# EAGLE design midiMeterClock (EAGLE 5.06)
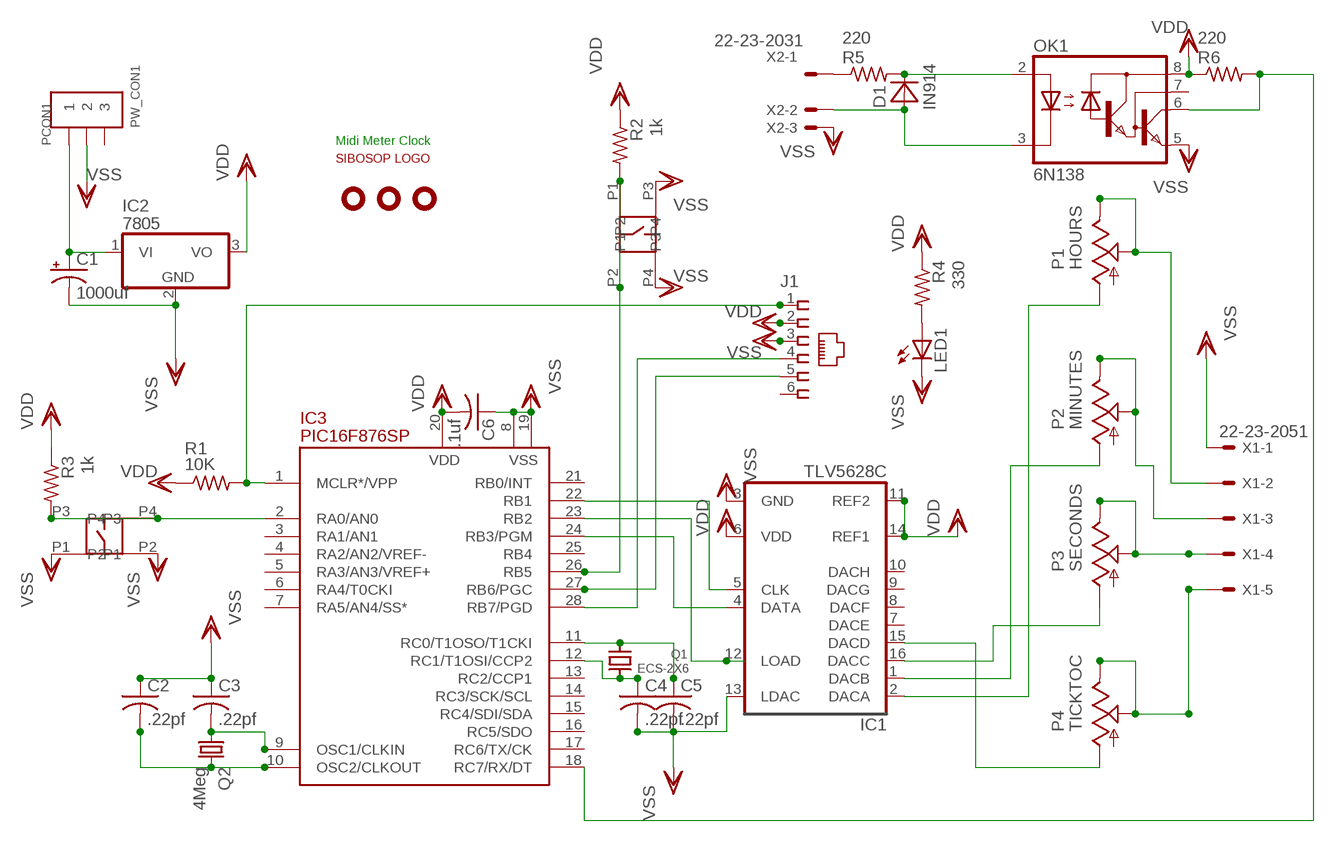
[diagram p0: schematic, sheet 1]

## Parts
C1  1000uf  CPOL-USE3.5-10  [E3,5-10]
C2  .22pf  C-US025-024X044  [C025-024X044]
C3  .22pf  C-US025-024X044  [C025-024X044]
C4  .22pf  C-US025-024X044  [C025-024X044]
C5  .22pf  C-US025-024X044  [C025-024X044]
C6  .1uf  C-US025-024X044  [C025-024X044]
D1  IN914  [DO35-10]
IC1  TLV5628C  [DIL16]
IC2  7805  [TO220V]
IC3  PIC16F876SP  [DIL28-3]
J1  520250-3  [520250-3]
LED1  LEDSQR2X5  [LED2X5]
OK1  6N138  [DIL08]
P1  HOURS  TRIMPOT  [RJ6S]
P2  MINUTES  TRIMPOT  [RJ6S]
P3  SECONDS  TRIMPOT  [RJ6S]
P4  TICKTOC  TRIMPOT  [RJ6S]
PCON1  PW_CON1  [PW_CON1]
Q1  ECS-2X6  [RADIAL-CRYSTAL-2.1MM]
Q2  4Meg  CRYSTALHC49S  [HC49/S]
R1  10K  R-US_0204/2V  [0204V]
R2  1k  R-US_0204/2V  [0204V]
R3  1k  R-US_0204/2V  [0204V]
R4  330  R-US_0204/2V  [0204V]
R5  220  R-US_0204/2V  [0204V]
R6  220  R-US_0204/2V  [0204V]
SW1  SW-B3W-1052  [SW-B3W-1052]
SW2  SW-B3W-1052  [SW-B3W-1052]
U$1  HOLE-125  [HOLE-125]
U$2  HOLE-125  [HOLE-125]
U$3  LOGO  [LOGO]
U$5  HOLE-125  [HOLE-125]
X1  22-23-2051  [22-23-2051]
X2  22-23-2031  [22-23-2031]

## Nets
N$1: IC3.1(MCLR*/VPP) J1.1 R1.2
N$2: C1.+ IC2.1(VI) PCON1.P$1
N$3: C2.2 IC3.10(OSC2/CLKOUT) Q2.2
N$4: C3.2 IC3.9(OSC1/CLKIN) Q2.1
N$5: P1.E P1.S X1.2
N$6: C5.1 IC3.11(RC0/T1OSO/T1CKI) Q1.1
N$7: C4.1 IC3.12(RC1/T1OSI/CCP2) Q1.2
N$8: P2.E P2.S X1.3
N$9: P3.E P3.S X1.4
N$10: P4.E P4.S X1.5
N$11: IC1.4(DATA) IC3.24(RB3/PGM)
N$12: IC3.2(RA0/AN0) R3.2 SW1.P3 SW1.P4
N$13: IC3.26(RB5) R2.2 SW2.P1 SW2.P2
N$14: IC3.27(RB6/PGC) J1.5
N$15: IC1.12(LOAD) IC3.23(RB2)
N$16: IC1.5(CLK) IC3.22(RB1)
N$17: IC1.16(DACC) P3.A
N$18: IC1.2(DACA) P1.A
N$19: IC1.1(DACB) P2.A
N$20: IC1.15(DACD) P4.A
N$21: IC3.28(RB7/PGD) J1.4
N$22: LED1.A R4.2
N$23: R5.1 X2.1
N$24: D1.C OK1.2(A) R5.2
N$25: D1.A OK1.3(C) X2.2
N$26: IC3.18(RC7/RX/DT) OK1.6(VO) R6.2
VDD: C6.2 IC1.6(VDD) IC1.11(REF2) IC1.14(REF1) IC2.3(VO) IC3.20(VDD) J1.2 OK1.8(VCC) R1.1 R2.1 R3.1 R4.1 R6.1
VSS: C1.- C2.1 C3.1 C4.2 C5.2 C6.1 IC1.3(GND) IC1.13(LDAC) IC2.2(GND) IC3.8(VSS) IC3.19(VSS) J1.3 LED1.K(C) OK1.5(GND) PCON1.P$2 SW1.P1 SW1.P2 SW2.P3 SW2.P4 X1.1 X2.3
Unconnected: IC1.7(DACE) IC1.8(DACF) IC1.9(DACG) IC1.10(DACH) IC3.3(RA1/AN1) IC3.4(RA2/AN2/VREF-) IC3.5(RA3/AN3/VREF+) IC3.6(RA4/T0CKI) IC3.7(RA5/AN4/SS*) IC3.13(RC2/CCP1) IC3.14(RC3/SCK/SCL) IC3.15(RC4/SDI/SDA) IC3.16(RC5/SDO) IC3.17(RC6/TX/CK) IC3.21(RB0/INT) IC3.25(RB4) J1.6 OK1.7(VB) PCON1.P$3

## Notes on the sheet
- Midi Meter Clock

## Library data of the parts
C1 = rcl:CPOL-US: POLARIZED CAPACITOR, American symbol
C2-C6 = rcl:C-US: CAPACITOR, American symbol
D1 = kmarx1:IN914: DIODE SWITCH, 1N914 MFG:VISHAY - 100PRV@25mA, 1Vf@10mA(10) Jameco #: 179207 OR 75V PRV @Ir5uA, Vf=1V@10mA (10) Jameco #: 3631
IC1 = kmarx1:TLV5628C
IC2 = kmarx1:78*: 78xx Family - Positive voltage regulator
IC3 = pic16f87x:PIC16F876: FLASH MICROCONTROLLER
J1 = con-amp:520250-3: AMP connector
LED1 = led:LED: LED OSRAM: - CHIPLED LG R971, LG N971, LY N971, LG Q971, LY Q971, LO R971, LY R971 LH N974, LH R974 LS Q976, LO Q976, LY Q976 LO Q996 - Hyper CHIPLED LW Q18S LB Q993, LB Q99A, LB R99A - SideLED LS A670, LO A670, LY A670, LG A670, LP A670 LB A673, LV A673, LT A673, LW A673 LH A674 LY A675 LS A676, LA A676, LO A676, LY A676, LW A676 LS A679, LY A679, LG A679 - Hyper Micro SIDELED® LS Y876, LA Y876, LO Y876, LY Y876 LT Y87S - SmartLED LW L88C, LW L88S LB L89C, LB L89S, LG L890 LS L89K, LO L89K, LY L89K LS L896, LA L896, LO L896, LY L896 - TOPLED LS T670, LO T670, LY T670, LG T670, LP T670 LSG T670, LSP T670, LSY T670, LOP T670, LYG T670 LG T671, LOG T671, LSG T671 LB T673, LV T673, LT T673, LW T673 LH T674 LS T676, LA T676, LO T676, LY T676, LB T676, LH T676, LSB T676, LW T676 LB T67C, LV T67C, LT T67C, LS T67K, LO T67K, LY T67K, LW E67C LS E67B, LA E67B, LO E67B, LY E67B, LB E67C, LV E67C, LT E67C LW T67C LS T679, LY T679, LG T679 LS T770, LO T770, LY T770, LG T770, LP T770 LB T773, LV T773, LT T773, LW T773 LH T774 LS E675, LA E675, LY E675, LS T675 LS T776, LA T776, LO T776, LY T776, LB T776 LHGB T686 LT T68C, LB T68C - Hyper Mini TOPLED® LB M676 - Mini TOPLED Santana® LG M470 LS M47K, LO M47K, LY M47K Source: http://www.osram.convergy.de - LUMILED® LXK2-PW12-R00, LXK2-PW12-S00, LXK2-PW14-U00, LXK2-PW14-V00 LXK2-PM12-R00, LXK2-PM12-S00, LXK2-PM14-U00 LXK2-PE12-Q00, LXK2-PE12-R00, LXK2-PE12-S00, LXK2-PE14-T00, LXK2-PE14-U00 LXK2-PB12-K00, LXK2-PB12-L00, LXK2-PB12-M00, LXK2-PB14-N00, LXK2-PB14-P00, LXK2-PB14-Q00 LXK2-PR12-L00, LXK2-PR12-M00, LXK2-PR14-Q00, LXK2-PR14-R00 LXK2-PD12-Q00, LXK2-PD12-R00, LXK2-PD12-S00 LXK2-PH12-R00, LXK2-PH12-S00 LXK2-PL12-P00, LXK2-PL12-Q00, LXK2-PL12-R00 Source: www.luxeon.com
OK1 = optocoupler:6N138: MOTOROLA OPTO COUPLER
P1-P4 = sibosop:TRIMPOT
PCON1 = powerconnectorskt:PW_CON1
Q1 = kmarx1:ECS-2X6: ECS 2x6 32khz Tuning Fork Crystal ECS-.327-12.5-13 digikey X802-ND
Q2 = crystal:CRYSTAL: CRYSTAL
R1-R6 = rcl:R-US_: RESISTOR, American symbol
SW1 SW2 = sibosop:SW-B3W-1052
U$1 U$2 U$5 = sibosop:HOLE-125
U$3 = sibosop:LOGO
X1 = sibosop-con-molex:22-23-2051: .100" (2.54mm) Center Header - 5 Pin
X2 = sibosop-con-molex:22-23-2031: .100" (2.54mm) Center Header - 3 Pin

## Board
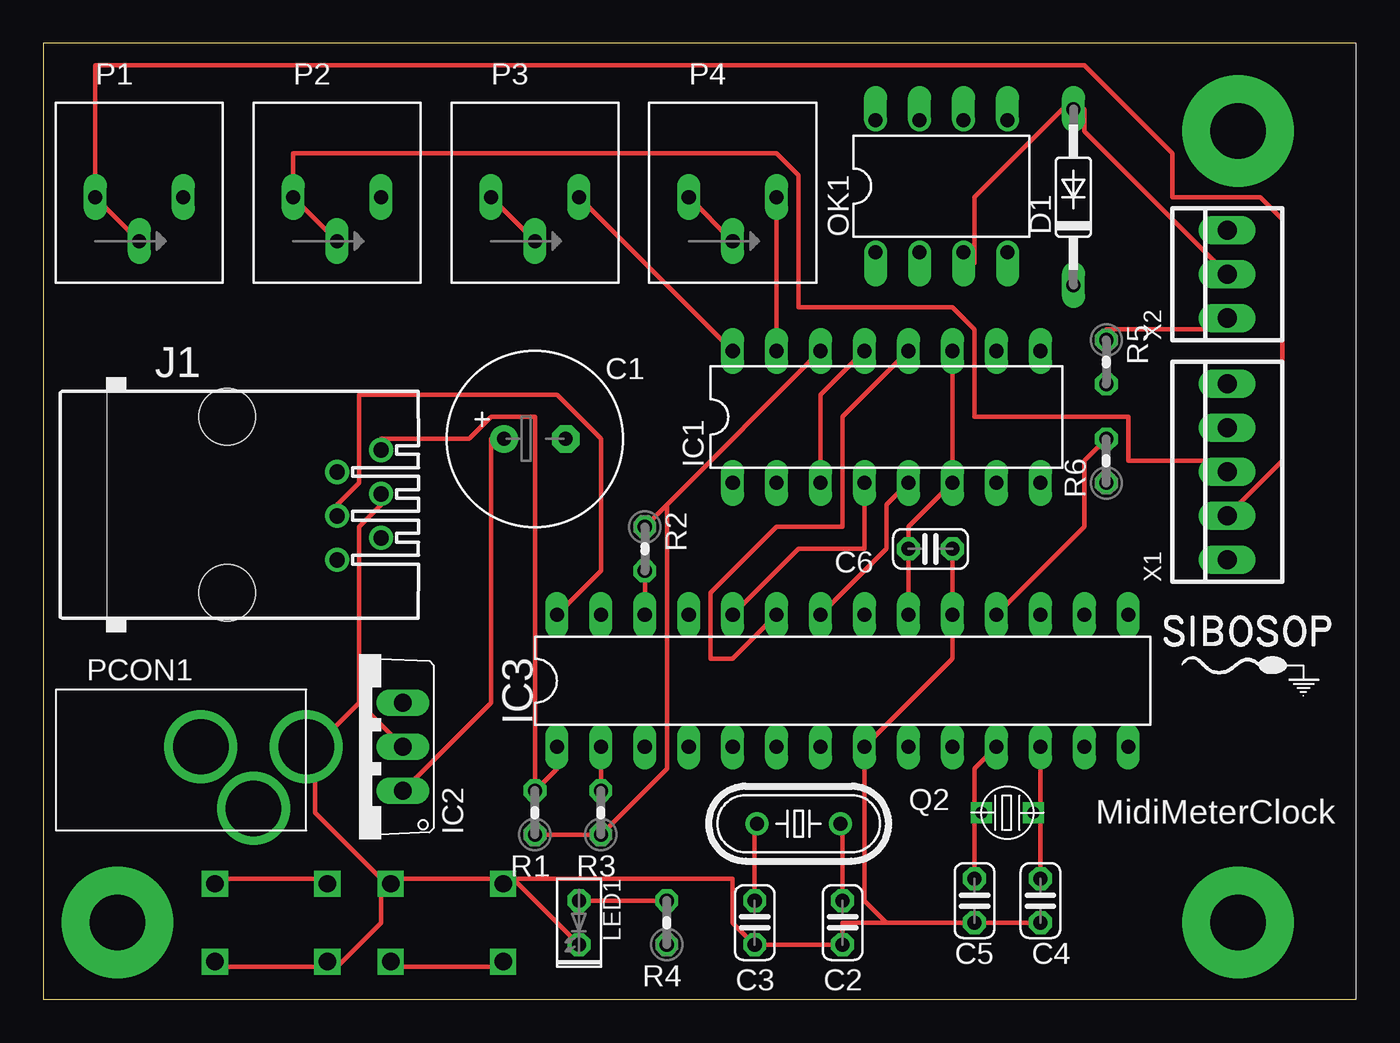
[diagram p1: board, top side]
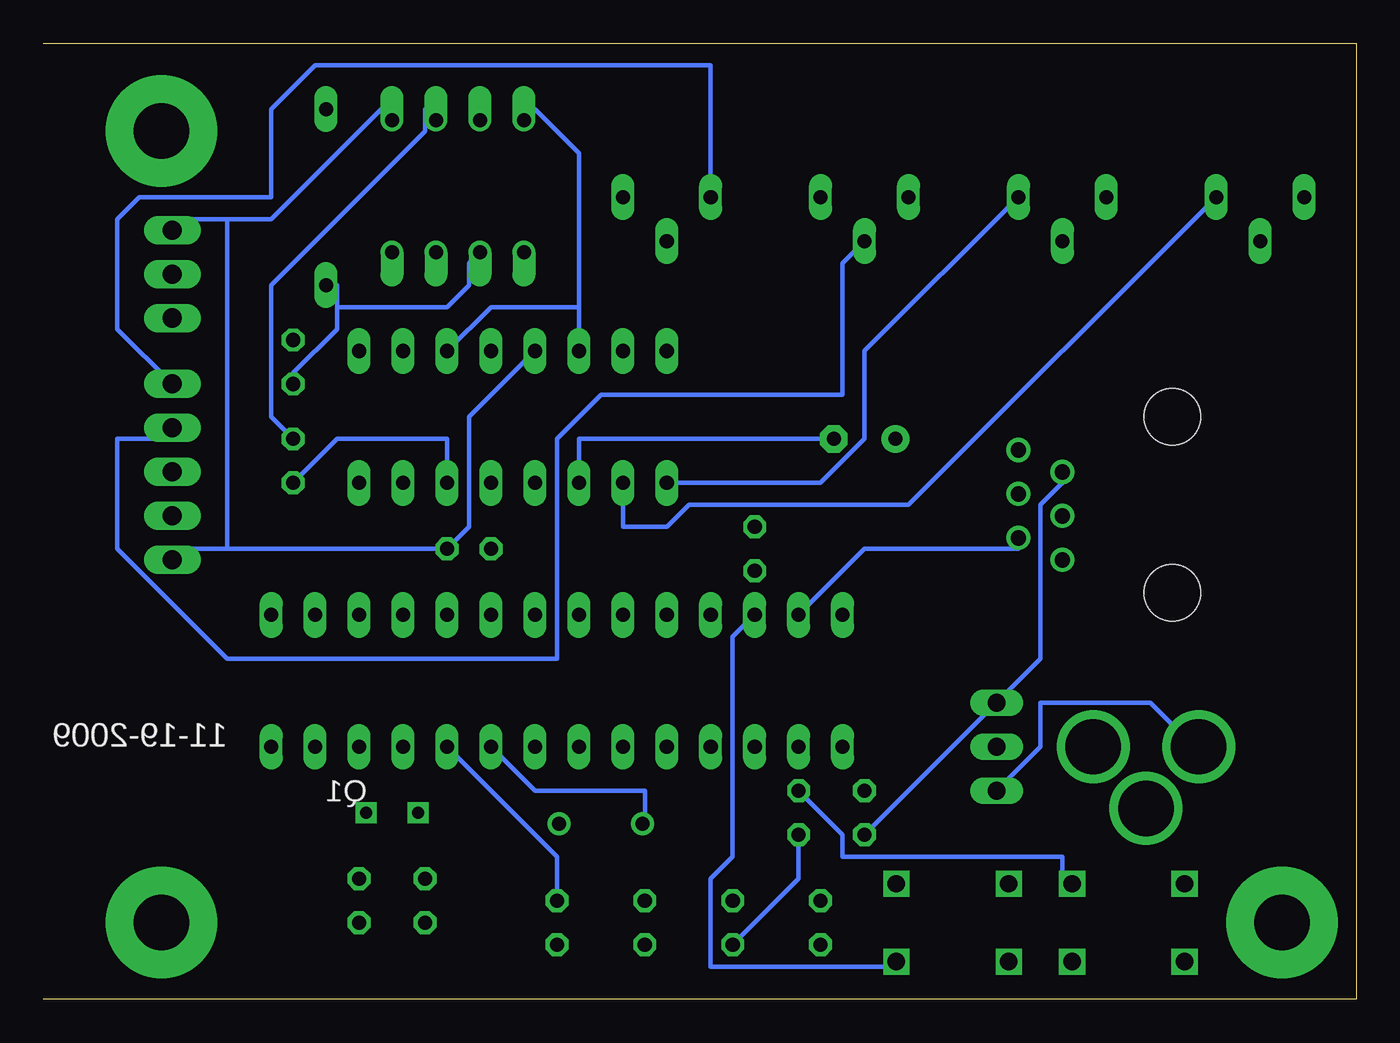
[diagram p2: board, bottom side, seen from below]

Size 75.87 x 55.23 mm. Coordinates in mm from the lower left corner, seen from the top.
Outline: 75.87,0 0,0 0,55.23 75.87,55.23
Copper layers (1*16): Top 0.035mm / dielectric 1.5mm / Bottom 0.035mm
Design rules "default": minimum track width 10mil, minimum drill 24mil, track to track 8mil, track to pad 8mil, pad to pad 8mil, via to via 8mil, smd to smd 8mil, copper to edge 40mil, drill to drill 8mil, minimum pad ring 10mil, minimum via ring 8mil, stop-mask expansion 4mil, vias tented up to drill 0mil, thermal gap 10mil

### Footprints (pad centres in the part's own frame; a part is rotated, then mirrored left to right if it is on the bottom)
E3,5-10 = drill 0.813 pad 1.6 round: + -1.778,0 | drill 0.813 pad 1.6 octagon: - 1.778,0
C025-024X044 = drill 0.813 octagon: 1 -1.27,0; 2 1.27,0
DO35-10 = drill 0.813 long: A 5.08,0; C -5.08,0
DIL16 = drill 0.813 long: 1 -8.89,-3.81; 2 -6.35,-3.81; 3 -3.81,-3.81; 4 -1.27,-3.81; 5 1.27,-3.81; 6 3.81,-3.81; 7 6.35,-3.81; 8 8.89,-3.81; 9 8.89,3.81; 10 6.35,3.81; 11 3.81,3.81; 12 1.27,3.81; 13 -1.27,3.81; 14 -3.81,3.81; 15 -6.35,3.81; 16 -8.89,3.81
TO220V = drill 1.016 long: 1 -2.54,0; 2 0,0; 3 2.54,0
DIL28-3 = drill 0.813 long: 1 -16.51,-3.81; 2 -13.97,-3.81; 3 -11.43,-3.81; 4 -8.89,-3.81; 5 -6.35,-3.81; 6 -3.81,-3.81; 7 -1.27,-3.81; 8 1.27,-3.81; 9 3.81,-3.81; 10 6.35,-3.81; 11 8.89,-3.81; 12 11.43,-3.81; 13 13.97,-3.81; 14 16.51,-3.81; 15 16.51,3.81; 16 13.97,3.81; 17 11.43,3.81; 18 8.89,3.81; 19 6.35,3.81; 20 3.81,3.81; 21 1.27,3.81; 22 -1.27,3.81; 23 -3.81,3.81; 24 -6.35,3.81; 25 -8.89,3.81; 26 -11.43,3.81; 27 -13.97,3.81; 28 -16.51,3.81
520250-3 = drill 0.889 round: 1 -3.175,8.89; 2 -1.905,6.35; 3 -0.635,8.89; 4 0.635,6.35; 5 1.905,8.89; 6 3.175,6.35 | hole 3.251: -5.08,0; 5.08,0
LED2X5 = drill 0.813 octagon: A -1.27,0; K 1.27,0
DIL08 = drill 0.813 offset: 1 -3.81,-3.81; 2 -1.27,-3.81; 3 1.27,-3.81; 4 3.81,-3.81; 5 3.81,3.81; 6 1.27,3.81; 7 -1.27,3.81; 8 -3.81,3.81
RJ6S = drill 0.813 long: A 2.54,0; E -2.54,0; S 0,-2.54
PW_CON1 = drill 3.2 pad 3.81 round: P$1 -0.254,0; P$2 5.842,0; P$3 2.794,-3.556
RADIAL-CRYSTAL-2.1MM = drill 0.7 square: 1 0,1.5; 2 0,-1.5
HC49/S = drill 0.813 round: 1 -2.413,0; 2 2.413,0
0204V = drill 0.813 octagon: 1 -1.27,0; 2 1.27,0
SW-B3W-1052 = drill 1 square: P1 3.25,-2.25; P2 -3.25,-2.25; P3 3.25,2.25; P4 -3.25,2.25
HOLE-125 = drill 3.2 pad 6.452 round: P$1 0,0
22-23-2051 = drill 1.1 long: 1 -5.08,0; 2 -2.54,0; 3 0,0; 4 2.54,0; 5 5.08,0
22-23-2031 = drill 1.1 long: 1 -2.54,0; 2 0,0; 3 2.54,0

### Placement (x,y rotation side)
C1  28.41,32.38 0 top
C2  46.19,4.44 90 top
C3  41.11,4.44 90 top
C4  57.62,5.71 270 top
C5  53.81,5.71 270 top
C6  51.27,26.03 180 top
D1  59.52,46.35 90 top
IC1  48.73,33.65 0 top
IC2  20.79,14.6 90 top
IC3  46.19,18.41 0 top
J1  10.63,28.57 270 top
LED1  30.95,4.44 270 top
OK1  51.91,46.98 0 top
P1  5.55,46.35 0 top
P2  16.98,46.35 0 top
P3  28.41,46.35 0 top
P4  39.84,46.35 0 top
PCON1  9.36,14.6 0 top
Q1  55.71,10.79 90 top
Q2  43.65,10.16 0 top
R1  28.41,10.79 90 top
R2  34.76,26.03 270 top
R3  32.22,10.79 90 top
R4  36.03,4.44 90 top
R5  61.43,36.83 270 top
R6  61.43,31.11 90 top
SW1  13.17,4.44 0 top
SW2  23.33,4.44 0 top
U$1  4.28,4.44 0 top
U$2  69.05,4.44 0 top
U$3  69.05,20.95 0 top
U$5  69.05,50.16 0 top
X1  68.41,30.47 90 top
X2  68.41,41.91 90 top

### Tracks (layer width: path | path; a pad name or v marks a point on that pad's centre or on a via)
N$1
  Top 0.254: IC3.1 29.68,13.33 R1.2 28.41,33.65 25.87,33.65 24.6,32.38 19.52,32.38 J1.1
N$2
  Top 0.254: IC2.1 25.87,17.14 25.87,32.38 C1.+
  Bottom 0.254: IC2.1 18.25,14.6 18.25,17.14 11.9,17.14 9.36,14.6 PCON1.P$1
N$3
  Top 0.254: C2.2 46.19,9.52 Q2.2
  Bottom 0.254: IC3.10 46.19,8.25 C2.2
N$4
  Top 0.254: C3.2 41.11,9.52 Q2.1
  Bottom 0.254: IC3.9 47.46,12.06 41.11,12.06 41.11,10.79 Q2.1
N$5
  Top 0.254: P1.S P1.E 3.01,53.97 60.16,53.97 65.24,48.89 65.24,46.35 70.32,46.35 71.59,45.08 71.59,31.11 X1.2
N$6
  Top 0.254: C5.1 53.81,10.79 | IC3.11 53.81,13.33 53.81,10.79 | 53.81,10.79 Q1.1
N$7
  Top 0.254: 57.62,10.79 IC3.12 | C4.1 57.62,10.79 | 57.62,10.79 Q1.2
N$8
  Top 0.254: P2.S P2.E 14.44,48.89 42.38,48.89 43.65,47.62 43.65,40 52.54,40 53.81,38.73 53.81,33.65 62.7,33.65 62.7,31.11 67.78,31.11 X1.3
N$9
  Top 0.254: P3.S P3.E
  Bottom 0.254: P3.S 29.68,42.54 29.68,34.92 43.65,34.92 46.19,32.38 46.19,19.68 65.24,19.68 71.59,26.03 71.59,32.38 69.05,32.38 X1.4
N$10
  Top 0.254: P4.S P4.E
  Bottom 0.254: P4.E 37.3,53.97 60.16,53.97 62.7,51.43 62.7,46.35 70.32,46.35 71.59,45.08 71.59,38.73 X1.5
N$11
  Top 0.254: IC3.24 43.65,26.03 47.46,26.03 IC1.4
N$12
  Top 0.254: R3.2 IC3.2 | SW1.P4 10.63,6.98 15.71,6.98 SW1.P3
  Bottom 0.254: R3.2 29.68,9.52 29.68,8.25 16.98,8.25 16.98,6.98 SW1.P3
N$13
  Top 0.254: IC3.26 R2.2 | SW2.P2 20.79,1.9 25.87,1.9 SW2.P1
  Bottom 0.254: IC3.26 36.03,20.95 36.03,8.25 37.3,6.98 37.3,1.9 27.14,1.9 SW2.P1
N$14
  Bottom 0.254: IC3.27 28.41,26.03 19.52,26.03 J1.5
N$15
  Top 0.254: IC3.23 39.84,19.68 38.57,19.68 38.57,23.49 42.38,27.3 46.19,27.3 46.19,33.65 IC1.12
N$16
  Top 0.254: IC3.22 48.73,26.03 48.73,28.57 IC1.5
N$17
  Top 0.254: IC1.16 P3.A
N$18
  Bottom 0.254: P1.A 25.87,28.57 38.57,28.57 39.84,27.3 42.38,27.3 IC1.2
N$19
  Bottom 0.254: P2.A 28.41,37.46 28.41,32.38 30.95,29.84 IC1.1
N$20
  Top 0.254: IC1.15 P4.A
N$21
  Top 0.254: IC3.28 32.22,24.76 32.22,32.38 29.68,34.92 18.25,34.92 18.25,29.84 16.98,28.57 J1.4
N$22
  Top 0.254: LED1.A R4.2
N$23
  Top 0.254: R5.1 61.43,38.73 67.78,38.73 X2.1
N$24
  Bottom 0.254: 58.89,40 52.54,40 51.27,41.27 51.27,42.54 OK1.2 | 58.89,40 58.89,41.27 D1.C | 58.89,40 58.89,38.73 61.43,36.19 R5.2
N$25
  Top 0.254: OK1.3 53.81,42.54 53.81,46.35 58.89,51.43 D1.A 60.16,51.43 60.16,50.16 X2.2
N$26
  Top 0.254: IC3.18 60.16,27.3 60.16,31.11 R6.2
  Bottom 0.254: R6.2 62.7,33.65 62.7,41.27 53.81,50.16 53.81,51.43 OK1.6
VDD
  Top 0.254: R1.1 R3.1 36.03,13.33 36.03,28.57 | IC3.20 C6.2 50,27.3 IC1.6 IC1.11 | 36.03,28.57 IC1.14 | 36.03,28.57 R2.1
  Bottom 0.254: R4.1 32.22,6.98 R3.1 | J1.2 16.98,29.84 18.25,28.57 18.25,19.68 IC2.3 R1.1 | R6.1 58.89,32.38 52.54,32.38 IC1.6 | IC1.14 44.92,40 | 44.92,40 44.92,48.89 47.46,51.43 OK1.8 | IC1.11 50,40 44.92,40
VSS
  Top 0.254: SW1.P2 10.63,1.9 15.71,1.9 SW1.P1 16.98,1.9 19.52,4.44 19.52,6.98 | 27.14,6.98 LED1.K | 18.25,17.14 18.25,27.3 19.52,28.57 J1.3 | 15.71,14.6 18.25,17.14 | 18.25,17.14 IC2.2 | 19.52,6.98 15.71,10.79 15.71,14.6 | 19.52,6.98 SW2.P4 20.79,6.98 25.87,6.98 SW2.P3 27.14,6.98 | 15.71,14.6 PCON1.P$2 | IC1.3 44.92,34.92 IC1.13 | C4.2 C5.2 48.73,4.44 | 48.73,4.44 46.19,4.44 C2.1 C3.1 39.84,4.44 39.84,6.98 27.14,6.98 | C6.1 IC3.19 52.54,19.68 IC3.8 47.46,5.71 48.73,4.44
  Bottom 0.254: IC1.3 44.92,32.38 C1.- | 65.24,45.08 67.78,45.08 X2.3 | 65.24,45.08 62.7,45.08 56.35,51.43 OK1.5 | 65.24,26.03 C6.1 51.27,27.3 51.27,33.65 IC1.13 | 65.24,26.03 67.78,26.03 X1.1 | 65.24,26.03 65.24,45.08

### Text on the board
tNames: MidiMeterClock
bNames: 11-19-2009